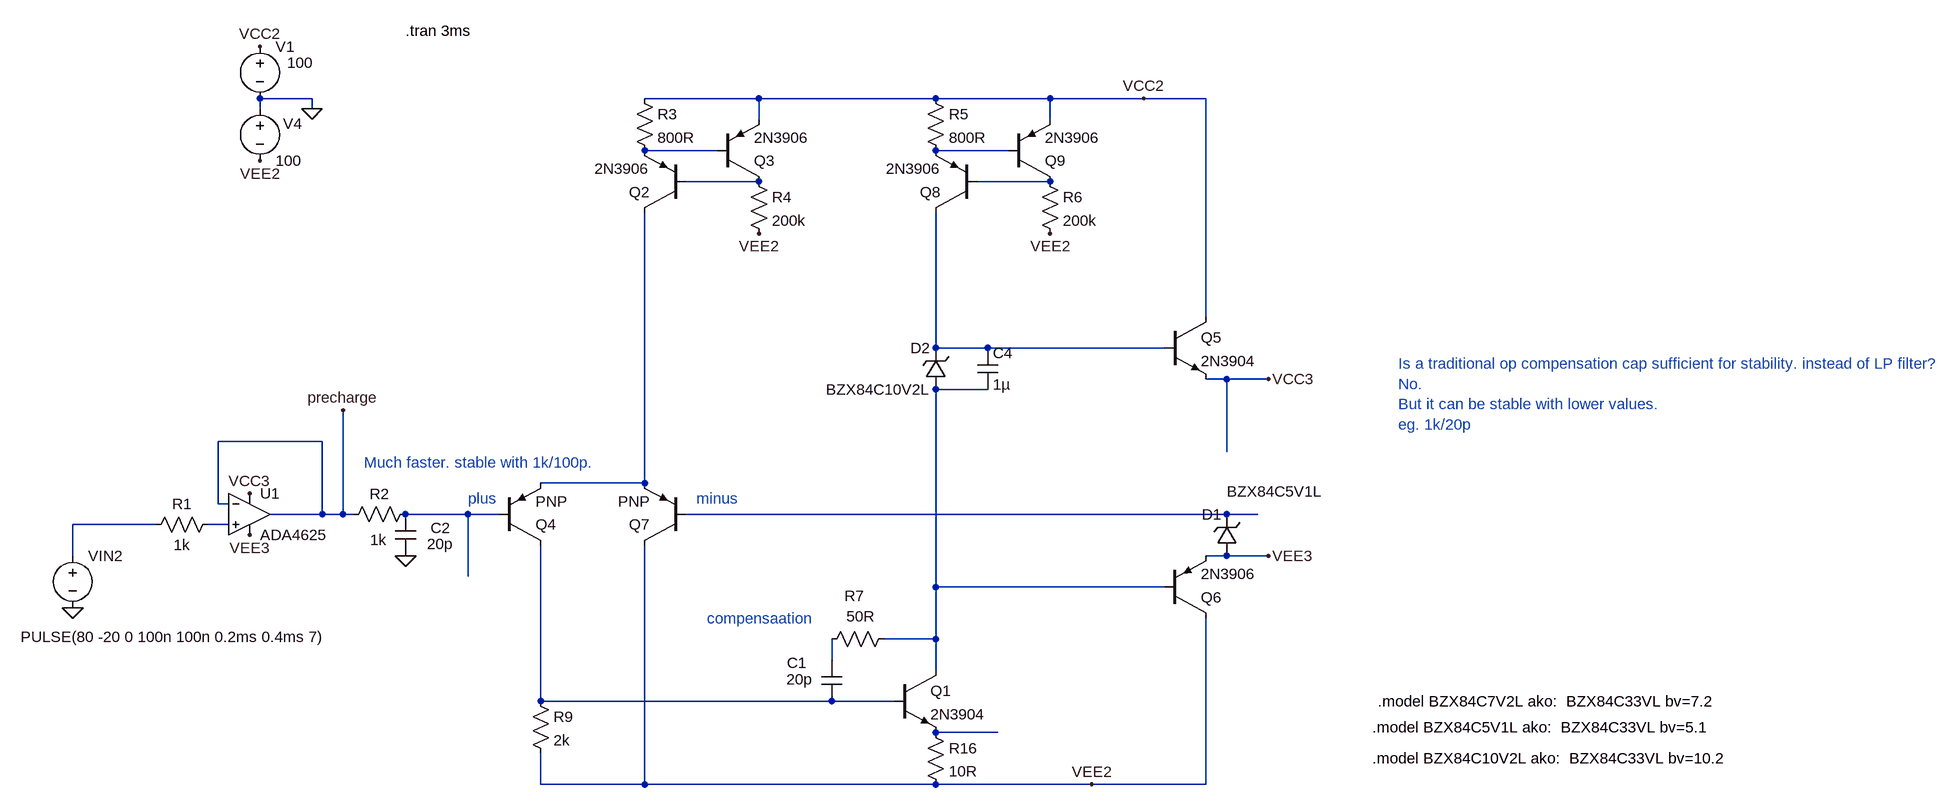
[diagram p0: schematic Draft54.asc]
Draft54.asc, the LTspice schematic file:
Version 4
SHEET 1 2756 992
WIRE -256 -288 -336 -288
WIRE 432 -288 256 -288
WIRE 704 -288 432 -288
WIRE 880 -288 704 -288
WIRE 1024 -288 880 -288
WIRE 1120 -288 1024 -288
WIRE -336 -272 -336 -288
WIRE -256 -272 -256 -288
WIRE 432 -256 432 -288
WIRE 880 -256 880 -288
WIRE 368 -208 256 -208
WIRE 816 -208 704 -208
WIRE 432 -160 320 -160
WIRE 880 -160 768 -160
WIRE 1120 48 1120 -288
WIRE 704 96 704 -112
WIRE 784 96 704 96
WIRE 1056 96 784 96
WIRE 1152 144 1120 144
WIRE 1216 144 1152 144
WIRE 784 160 704 160
WIRE -240 240 -400 240
WIRE 1152 256 1152 144
WIRE 256 304 256 -112
WIRE 256 304 96 304
WIRE -400 336 -400 240
WIRE -384 336 -400 336
WIRE -240 352 -240 240
WIRE -240 352 -320 352
WIRE -208 352 -208 192
WIRE -208 352 -240 352
WIRE -192 352 -208 352
WIRE -16 352 -112 352
WIRE 32 352 -16 352
WIRE 1152 352 320 352
WIRE 1200 352 1152 352
WIRE -496 368 -624 368
WIRE -384 368 -416 368
WIRE -624 416 -624 368
WIRE 1152 416 1120 416
WIRE 1216 416 1152 416
WIRE -16 448 -16 352
WIRE 704 464 704 160
WIRE 1056 464 704 464
WIRE 704 544 704 464
WIRE 704 544 624 544
WIRE 544 576 544 544
WIRE 704 592 704 544
WIRE 96 640 96 400
WIRE 544 640 96 640
WIRE 640 640 544 640
WIRE 800 688 704 688
WIRE 96 768 96 720
WIRE 256 768 256 400
WIRE 256 768 96 768
WIRE 704 768 256 768
WIRE 944 768 704 768
WIRE 1120 768 1120 512
WIRE 1120 768 944 768
FLAG -256 -272 0
FLAG -336 -368 VCC2
FLAG -336 -192 VEE2
FLAG 944 768 VEE2
FLAG -624 496 0
FLAG 1216 144 VCC3
FLAG 1216 416 VEE3
FLAG -352 320 VCC3
FLAG -352 384 VEE3
FLAG -112 416 0
FLAG 432 -80 VEE2
FLAG 1024 -288 VCC2
FLAG 880 -80 VEE2
FLAG -208 192 precharge
SYMBOL voltage -336 -384 R0
WINDOW 123 0 0 Left 0
WINDOW 39 0 0 Left 0
WINDOW 3 42 41 Left 2
SYMATTR Value 100
SYMATTR InstName V1
SYMBOL voltage -336 -288 R0
WINDOW 123 0 0 Left 0
WINDOW 39 0 0 Left 0
WINDOW 0 36 39 Left 2
SYMATTR InstName V4
SYMATTR Value 100
SYMBOL npn 1056 48 R0
SYMATTR InstName Q5
SYMATTR Value 2N3904
SYMBOL pnp 1056 512 M180
SYMATTR InstName Q6
SYMATTR Value 2N3906
SYMBOL res 80 624 R0
SYMATTR InstName R9
SYMATTR Value 2k
SYMBOL res 688 672 R0
SYMATTR InstName R16
SYMATTR Value 10R
SYMBOL pnp 32 400 M180
SYMATTR InstName Q4
SYMBOL pnp 320 400 R180
SYMATTR InstName Q7
SYMBOL voltage -624 400 R0
WINDOW 123 0 0 Left 0
WINDOW 39 0 0 Left 0
WINDOW 3 -80 141 Left 2
SYMATTR Value PULSE(80 -20 0 100n 100n 0.2ms 0.4ms 7)
SYMATTR InstName VIN2
SYMBOL res -400 352 R90
WINDOW 0 0 56 VBottom 2
WINDOW 3 32 56 VTop 2
SYMATTR InstName R1
SYMATTR Value 1k
SYMBOL res -96 336 R90
WINDOW 0 0 56 VBottom 2
WINDOW 3 40 58 VTop 2
SYMATTR InstName R2
SYMATTR Value 1k
SYMBOL cap 768 96 R0
SYMATTR InstName C4
SYMATTR Value 1µ
SYMBOL OpAmps\\ADA4625 -352 288 R0
SYMATTR InstName U1
SYMBOL zener 720 160 R180
WINDOW 0 24 64 Left 2
WINDOW 3 24 0 Left 2
SYMATTR InstName D2
SYMATTR Value BZX84C10V2L
SYMBOL npn 640 592 R0
SYMATTR InstName Q1
SYMATTR Value 2N3904
SYMBOL pnp 320 -112 R180
SYMATTR InstName Q2
SYMATTR Value 2N3906
SYMBOL pnp 368 -160 M180
SYMATTR InstName Q3
SYMATTR Value 2N3906
SYMBOL res 240 -304 R0
SYMATTR InstName R3
SYMATTR Value 800R
SYMBOL res 416 -176 R0
SYMATTR InstName R4
SYMATTR Value 200k
SYMBOL pnp 768 -112 R180
SYMATTR InstName Q8
SYMATTR Value 2N3906
SYMBOL pnp 816 -160 M180
SYMATTR InstName Q9
SYMATTR Value 2N3906
SYMBOL res 688 -304 R0
SYMATTR InstName R5
SYMATTR Value 800R
SYMBOL res 864 -176 R0
SYMATTR InstName R6
SYMATTR Value 200k
SYMBOL zener 1168 416 R180
WINDOW 0 24 64 Left 2
WINDOW 3 -131 99 Left 2
SYMATTR InstName D1
SYMATTR Value BZX84C5V1L
SYMBOL res 640 528 R90
WINDOW 0 -35 61 VBottom 2
WINDOW 3 -34 51 VTop 2
SYMATTR InstName R7
SYMATTR Value 50R
SYMBOL cap 528 576 R0
WINDOW 0 -53 5 Left 2
WINDOW 3 -54 30 Left 2
SYMATTR InstName C1
SYMATTR Value 20p
SYMBOL cap -128 352 R0
WINDOW 0 55 21 Left 2
WINDOW 3 49 46 Left 2
SYMATTR InstName C2
SYMATTR Value 20p
TEXT -112 -392 Left 2 !.tran 3ms
TEXT 336 328 Left 2 ;minus
TEXT -16 328 Left 2 ;plus
TEXT 1376 680 Left 2 !.model BZX84C5V1L ako:  BZX84C33VL bv=5.1
TEXT 1384 640 Left 2 !.model BZX84C7V2L ako:  BZX84C33VL bv=7.2
TEXT -176 272 Left 2 ;Much faster. stable with 1k/100p.
TEXT 1376 728 Left 2 !.model BZX84C10V2L ako:  BZX84C33VL bv=10.2
TEXT 1416 120 Left 2 ;Is a traditional op compensation cap sufficient for stability. instead of LP filter?\nNo.\nBut it can be stable with lower values.\neg. 1k/20p
TEXT 352 512 Left 2 ;compensaation

The netlist it stands for:
* Draft54.asc
V1 VCC2 0 100
V4 0 VEE2 100
Q5 VCC2 N005 VCC3 0 2N3904
Q6 VEE2 N006 VEE3 0 2N3906
R9 N013 VEE2 2k
R16 N014 VEE2 10R
Q4 N013 N008 N007 0 PNP
Q7 VEE2 N009 N007 0 PNP
VIN2 N010 0 PULSE(80 -20 0 100n 100n 0.2ms 0.4ms 7)
R1 N011 N010 1k
R2 N008 precharge 1k
C4 N005 N006 1µ
XU1 N011 precharge VCC3 VEE3 precharge ADA4625  ; pins In+ In- V+ V- OUT
D2 N006 N005 BZX84C10V2L
Q1 N006 N013 N014 0 2N3904
Q2 N007 N003 N001 0 2N3906
Q3 N003 N001 VCC2 0 2N3906
R3 VCC2 N001 800R
R4 N003 VEE2 200k
Q8 N005 N004 N002 0 2N3906
Q9 N004 N002 VCC2 0 2N3906
R5 VCC2 N002 800R
R6 N004 VEE2 200k
D1 VEE3 N009 BZX84C5V1L
R7 N006 N012 50R
C1 N012 N013 20p
C2 N008 0 20p
.model D D
.lib standard.dio
.model NPN NPN
.model PNP PNP
.lib standard.bjt
.tran 3ms
* minus
* plus
.model BZX84C5V1L ako:  BZX84C33VL bv=5.1
.model BZX84C7V2L ako:  BZX84C33VL bv=7.2
* Much faster. stable with 1k/100p.
.model BZX84C10V2L ako:  BZX84C33VL bv=10.2
* Is a traditional op compensation cap sufficient for stability. instead of LP filter?
* No.
* But it can be stable with lower values.
* eg. 1k/20p
* compensaation
.backanno
.end